# Altium project MoonPilot_Logic.PrjPcb
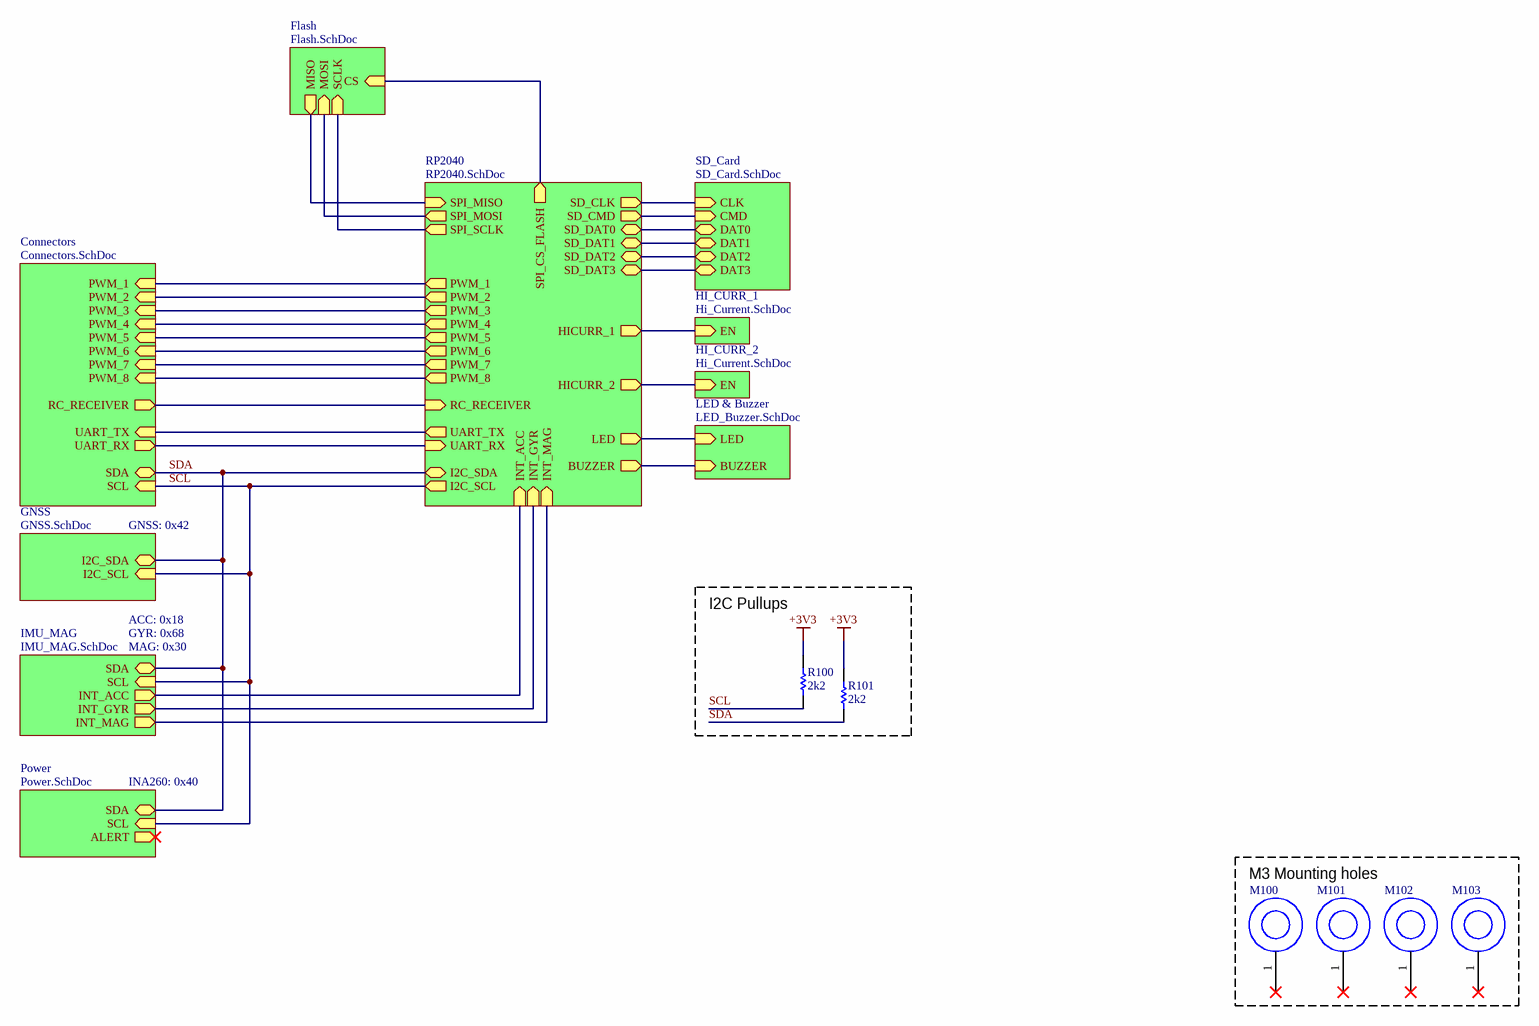
[diagram p0: Main.SchDoc]
11 sheets, 139 parts. Net scope: hierarchical (ports join the sheet entries above them; power ports are global).
Board file: MoonPilot_Logic.PcbDoc
Sheets:
  Main.SchDoc
    RP2040 = RP2040.SchDoc
    GNSS = GNSS.SchDoc
    IMU_MAG = IMU_MAG.SchDoc
    Power = Power.SchDoc
    Connectors = Connectors.SchDoc
    HI_CURR_1 = Hi_Current.SchDoc
    HI_CURR_2 = Hi_Current.SchDoc
    SD_Card = SD_Card.SchDoc
    Flash = Flash.SchDoc
  MCU_3.6.SchDoc
  RGB_LED.SchDoc

## Sheet Main.SchDoc: MoonPilot - Main
size A3; DrawnBy: Máni Magnússon; Revision: A; SheetNumber: 1

### Parts
M100  Mounting Screw  [M3_SCREW]  (value not drawn)
M101  Mounting Screw  [M3_SCREW]  (value not drawn)
M102  Mounting Screw  [M3_SCREW]  (value not drawn)
M103  Mounting Screw  [M3_SCREW]  (value not drawn)
R100  2k2  [0603_RES]
R101  2k2  [0603_RES]

### Blocks framed on the sheet
I2C Pullups: R100 R101
M3 Mounting holes: M100-M103

### Sub-sheets
Connectors = Connectors.SchDoc: PWM_1 (in), PWM_2 (in), PWM_3 (in), PWM_4 (in), PWM_5 (in), PWM_6 (in), PWM_7 (in), PWM_8 (in), SDA (bidir), SCL (in), RC_RECEIVER (out), UART_TX (in), UART_RX (out)
Flash = Flash.SchDoc: MISO (out), MOSI (in), SCLK (in), CS (in)
GNSS = GNSS.SchDoc: I2C_SCL (in), I2C_SDA (bidir)
HI_CURR_1 = Hi_Current.SchDoc: EN (in)
HI_CURR_2 = Hi_Current.SchDoc: EN (in)
IMU_MAG = IMU_MAG.SchDoc: SDA (bidir), SCL (in), INT_ACC (out), INT_GYR (out), INT_MAG (out)
LED & Buzzer = LED_Buzzer.SchDoc (file not in this document): BUZZER (in), LED (in)
Power = Power.SchDoc: SCL (in), SDA (bidir), ALERT (out)
RP2040 = RP2040.SchDoc: PWM_1 (out), PWM_2 (out), PWM_3 (out), PWM_4 (out), PWM_5 (out), PWM_6 (out), PWM_7 (out), PWM_8 (out), HICURR_1 (out), HICURR_2 (out), UART_TX (out), UART_RX (in), I2C_SDA (bidir), I2C_SCL (out), SPI_MISO (in), SPI_MOSI (out), SPI_SCLK (out), SPI_CS_FLASH (out), SD_CLK (out), SD_CMD (out), SD_DAT0 (bidir), SD_DAT1 (bidir), SD_DAT2 (bidir), SD_DAT3 (bidir), RC_RECEIVER (in), LED (out), INT_MAG (in), INT_GYR (in), INT_ACC (in), BUZZER (out)
SD_Card = SD_Card.SchDoc: CLK (in), CMD (in), DAT0 (bidir), DAT1 (bidir), DAT2 (bidir), DAT3 (bidir)

### Nets
+3V3: R100.1 R101.1
SCL: R100.2 ; sheet RP2040/I2C_SCL, sheet GNSS/I2C_SCL, sheet IMU_MAG/SCL, sheet Power/SCL, sheet Connectors/SCL
SDA: R101.2 ; sheet RP2040/I2C_SDA, sheet GNSS/I2C_SDA, sheet IMU_MAG/SDA, sheet Power/SDA, sheet Connectors/SDA
NetJ600_1: sheet RP2040/PWM_1, sheet Connectors/PWM_1
NetJ601_1: sheet RP2040/PWM_2, sheet Connectors/PWM_2
NetJ602_1: sheet RP2040/PWM_3, sheet Connectors/PWM_3
NetJ603_1: sheet RP2040/PWM_4, sheet Connectors/PWM_4
NetJ604_1: sheet RP2040/PWM_5, sheet Connectors/PWM_5
NetJ605_2: sheet RP2040/RC_RECEIVER, sheet Connectors/RC_RECEIVER
NetJ606_1: sheet RP2040/PWM_6, sheet Connectors/PWM_6
NetJ607_1: sheet RP2040/PWM_7, sheet Connectors/PWM_7
NetJ608_1: sheet RP2040/PWM_8, sheet Connectors/PWM_8
NetJ609_2: sheet RP2040/UART_RX, sheet Connectors/UART_RX
NetJ609_3: sheet RP2040/UART_TX, sheet Connectors/UART_TX
NetJ800_P1: sheet RP2040/SD_DAT2, sheet SD_Card/DAT2
NetJ800_P2: sheet RP2040/SD_DAT3, sheet SD_Card/DAT3
NetJ800_P3: sheet RP2040/SD_CMD, sheet SD_Card/CMD
NetJ800_P5: sheet RP2040/SD_CLK, sheet SD_Card/CLK
NetJ800_P7: sheet RP2040/SD_DAT0, sheet SD_Card/DAT0
NetJ800_P8: sheet RP2040/SD_DAT1, sheet SD_Card/DAT1
NetR?_1: sheet RP2040/SPI_CS_FLASH, sheet Flash/CS
NetU201_11: sheet RP2040/INT_ACC, sheet IMU_MAG/INT_ACC
NetU201_12: sheet RP2040/INT_GYR, sheet IMU_MAG/INT_GYR
NetU201_13: sheet RP2040/INT_MAG, sheet IMU_MAG/INT_MAG
NetU201_14: sheet RP2040/BUZZER, sheet LED & Buzzer/BUZZER
NetU201_27: sheet RP2040/SPI_MISO, sheet Flash/MISO
NetU201_29: sheet RP2040/SPI_SCLK, sheet Flash/SCLK
NetU201_30: sheet RP2040/SPI_MOSI, sheet Flash/MOSI
NetU201_32: sheet RP2040/LED, sheet LED & Buzzer/LED
NetU201_40: sheet RP2040/HICURR_1, sheet HI_CURR_1/EN
NetU201_41: sheet RP2040/HICURR_2, sheet HI_CURR_2/EN

Not connected (* = marked no-connect by the designer): M100 1(19)*; M101 1(19)*; M102 1(19)*; M103 1(19)*

### Notes on the sheet
- GNSS: 0x42
- ACC: 0x18
- GYR: 0x68
- MAG: 0x30
- INA260: 0x40
- Sheet title:
- Revision:
- Drawn by:
- Date:
- File:

### Library data of the parts
M100-M103 = Mounting Screw: M4 and M3 scew holes, just pick the right footprint
R100 R101 = Resistor

## Sheet RP2040.SchDoc: MoonPilot - RP2040
size A3; DrawnBy: Máni Magnússon; Revision: A; SheetNumber: 2
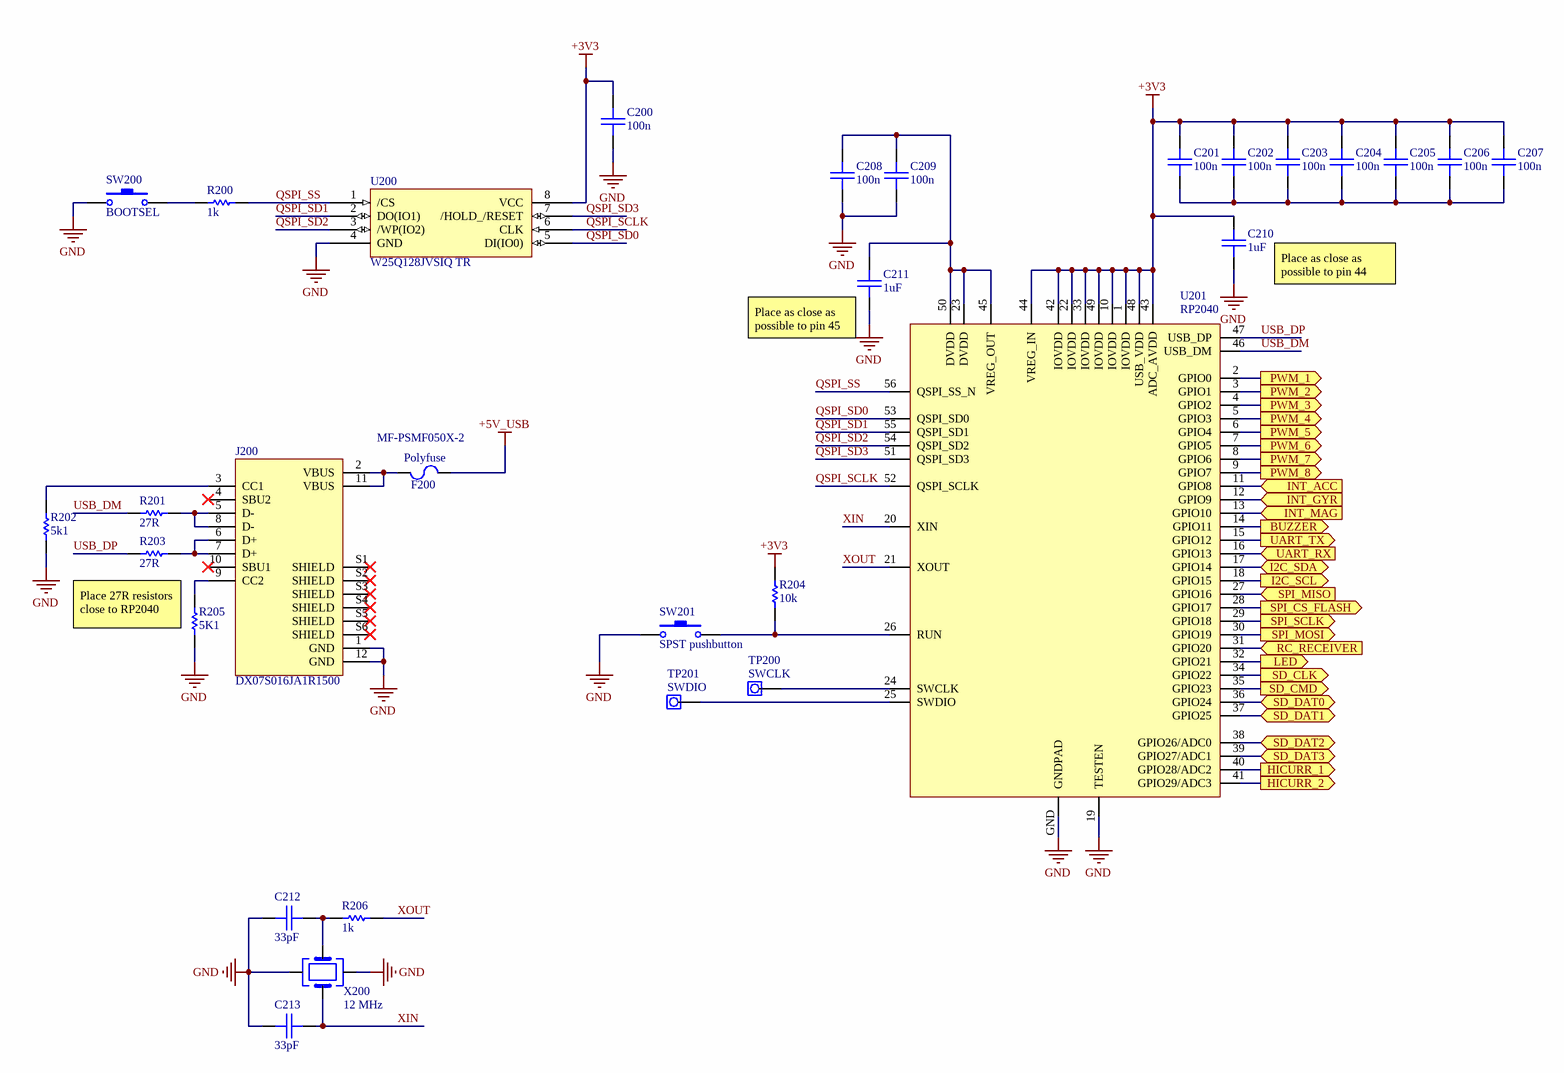
[diagram p1: RP2040.SchDoc]

### Parts
C200  100n  [0603_CAP]
C201  100n  [0603_CAP]
C202  100n  [0603_CAP]
C203  100n  [0603_CAP]
C204  100n  [0603_CAP]
C205  100n  [0603_CAP]
C206  100n  [0603_CAP]
C207  100n  [0603_CAP]
C208  100n  [0603_CAP]
C209  100n  [0603_CAP]
C210  1uF  [0603_CAP]
C211  1uF  [0603_CAP]
C212  33pF  [0603_CAP]
C213  33pF  [0603_CAP]
F200  Polyfuse  [0805]
J200  DX07S016JA1R1500  [JAE_DX07S016JA1R1500]
R200  1k  [0603_RES]
R201  27R  [0603_RES]
R202  5k1  [0603_RES]
R203  27R  [0603_RES]
R204  10k  [0805_RES]
R205  5K1  [0603_RES]
R206  1k  [0603_RES]
SW200  BOOTSEL  [TL1015]
SW201  SPST pushbutton  [TL1015]
TP200  SWCLK  [Testpoint]
TP201  SWDIO  [Testpoint]
U200  W25Q128JVSIQ TR  [SOIC_208MIL_WIN]
U201  RP2040  [RP2040]
X200  12 MHz  [XOSC_3.2mmx2.5mm]

### Ports
BUZZER (out), HICURR_1 (out), HICURR_2 (out), I2C_SCL (out), I2C_SDA (bidir), INT_ACC (in), INT_GYR (in), INT_MAG (in), LED (out), PWM_1 (out), PWM_2 (out), PWM_3 (out), PWM_4 (out), PWM_5 (out), PWM_6 (out), PWM_7 (out), PWM_8 (out), RC_RECEIVER (in), SD_CLK (out), SD_CMD (out), SD_DAT0 (bidir), SD_DAT1 (bidir), SD_DAT2 (bidir), SD_DAT3 (bidir), SPI_CS_FLASH (out), SPI_MISO (in), SPI_MOSI (out), SPI_SCLK (out), UART_RX (in), UART_TX (out)

### Nets
+3V3: C200.1 C201.1 C202.1 C203.1 C204.1 C205.1 C206.1 C207.1 C210.1 R204.1 U200.8(VCC) U201.1(IOVDD) U201.10(IOVDD) U201.22(IOVDD) U201.33(IOVDD) U201.42(IOVDD) U201.43(ADC_AVDD) U201.44(VREG_IN) U201.48(USB_VDD) U201.49(IOVDD)
+5V_USB: F200.2
GND: C200.2 C208.2 C209.2 C210.2 C211.2 C212.2 C213.2 J200.1(GND) J200.12(GND) R202.2 R205.2 SW200.1 SW201.1 U200.4(GND) U201.19(TESTEN) U201.GND(GNDPAD) X200.2 X200.4
QSPI_SCLK: U200.6(CLK) U201.52(QSPI_SCLK)
QSPI_SD0: U200.5(DI(IO0)) U201.53(QSPI_SD0)
QSPI_SD1: U200.2(DO(IO1)) U201.55(QSPI_SD1)
QSPI_SD2: U200.3(/WP(IO2)) U201.54(QSPI_SD2)
QSPI_SD3: U200.7(/HOLD_/RESET) U201.51(QSPI_SD3)
QSPI_SS: R200.2 U200.1(/CS) U201.56(QSPI_SS_N)
SCL: U201.18(GPIO15) ; port I2C_SCL
SDA: U201.17(GPIO14) ; port I2C_SDA
USB_DM: R201.1 U201.46(USB_DM)
USB_DP: R203.1 U201.47(USB_DP)
XIN: C213.1 U201.20(XIN) X200.1
XOUT: R206.1 U201.21(XOUT)
NetC201_2: C201.2 C202.2 C203.2 C204.2 C205.2 C206.2 C207.2
NetC208_1: C208.1 C209.1 C211.1 U201.23(DVDD) U201.45(VREG_OUT) U201.50(DVDD)
NetC212_1: C212.1 R206.2 X200.3
NetF200_1: F200.1 J200.2(VBUS) J200.11(VBUS)
NetJ200_3: J200.3(CC1) R202.1
NetJ200_5: J200.5(D-) J200.8(D-) R201.2
NetJ200_6: J200.6(D+) J200.7(D+) R203.2
NetJ200_9: J200.9(CC2) R205.1
NetJ600_1: U201.2(GPIO0) ; port PWM_1
NetJ601_1: U201.3(GPIO1) ; port PWM_2
NetJ602_1: U201.4(GPIO2) ; port PWM_3
NetJ603_1: U201.5(GPIO3) ; port PWM_4
NetJ604_1: U201.6(GPIO4) ; port PWM_5
NetJ605_2: U201.31(GPIO20) ; port RC_RECEIVER
NetJ606_1: U201.7(GPIO5) ; port PWM_6
NetJ607_1: U201.8(GPIO6) ; port PWM_7
NetJ608_1: U201.9(GPIO7) ; port PWM_8
NetJ609_2: U201.16(GPIO13) ; port UART_RX
NetJ609_3: U201.15(GPIO12) ; port UART_TX
NetJ800_P1: U201.38(GPIO26/ADC0) ; port SD_DAT2
NetJ800_P2: U201.39(GPIO27/ADC1) ; port SD_DAT3
NetJ800_P3: U201.35(GPIO23) ; port SD_CMD
NetJ800_P5: U201.34(GPIO22) ; port SD_CLK
NetJ800_P7: U201.36(GPIO24) ; port SD_DAT0
NetJ800_P8: U201.37(GPIO25) ; port SD_DAT1
NetR200_1: R200.1 SW200.2
NetR204_2: R204.2 SW201.2 U201.26(RUN)
NetR?_1: U201.28(GPIO17) ; port SPI_CS_FLASH
NetTP200_1: TP200.1 U201.24(SWCLK)
NetTP201_1: TP201.1 U201.25(SWDIO)
NetU201_11: U201.11(GPIO8) ; port INT_ACC
NetU201_12: U201.12(GPIO9) ; port INT_GYR
NetU201_13: U201.13(GPIO10) ; port INT_MAG
NetU201_14: U201.14(GPIO11) ; port BUZZER
NetU201_27: U201.27(GPIO16) ; port SPI_MISO
NetU201_29: U201.29(GPIO18) ; port SPI_SCLK
NetU201_30: U201.30(GPIO19) ; port SPI_MOSI
NetU201_32: U201.32(GPIO21) ; port LED
NetU201_40: U201.40(GPIO28/ADC2) ; port HICURR_1
NetU201_41: U201.41(GPIO29/ADC3) ; port HICURR_2

Not connected (* = marked no-connect by the designer): J200 4(SBU2)* 10(SBU1)* S1(SHIELD)* S2(SHIELD)* S3(SHIELD)* S4(SHIELD)* S5(SHIELD)* S6(SHIELD)*

### Notes on the sheet
- (near C210) Place as close as possible to pin 44
- (near C211) Place as close as possible to pin 45
- MF-PSMF050X-2
- (near R205) Place 27R resistors close to RP2040
- Sheet title:
- Revision:
- Drawn by:
- Date:
- File:

### Library data of the parts
C200-C213 = Capacitor
F200 = Fuse
J200 = DX07S016JA1R1500: USB 2.0 Type C Receptacle Dip Type, PCB Top Mount (Digikey part no. 670-DX07S016JA1R1500CT-ND); MF: JAE Electronics; Value: *; Price: None; Package: None; Availability: Unavailable; MP: DX07S016JA1R1500; DigiKey-Purchase-URL: https://snapeda.com/shop?store=DigiKey&id=4551013; SnapEDA_Link: https://www.snapeda.com/parts/DX07S016JA1R1500/JAE%20Electronics/view-part/4551013/?ref=snap
R200-R206 = Resistor
SW200 SW201 = PushButton: DigiKey part no. EG4344CT-ND
TP200 TP201 = Testpoint
U200 = W25Q128JVSIQ TR: No Description Available; Vendor: Winbond; Built_By: EMA_Cory; SourceLibrary: Winbond_2020-02-06; Datasheet: https://www.winbond.com/resource-files/w25q128jv%20revf%2003272018%20plus.pdf; Manufacturer_Part_Number: W25Q128JVSIQ TR; Copyright: Copyright (C) 2018 Accelerated Designs. All rights reserved; RefDes: RefDes; Type: DEV
X200 = XTAL_12 MHz: 12 MHz crystal oscillator / ECS-120-20-33-CKM-TR / DigiKey part no. XC1810CT-ND; ComponentLink1Description: DigiKey; ComponentLink1URL: https://www.digikey.com/en/products/detail/ecs-inc/ECS-120-20-33-CKM-TR/2781815; DigiKey: XC1810CT-ND

## Sheet GNSS.SchDoc: MoonPilot - GNSS
size A3; DrawnBy: Máni Magnússon; Revision: A; SheetNumber: 3
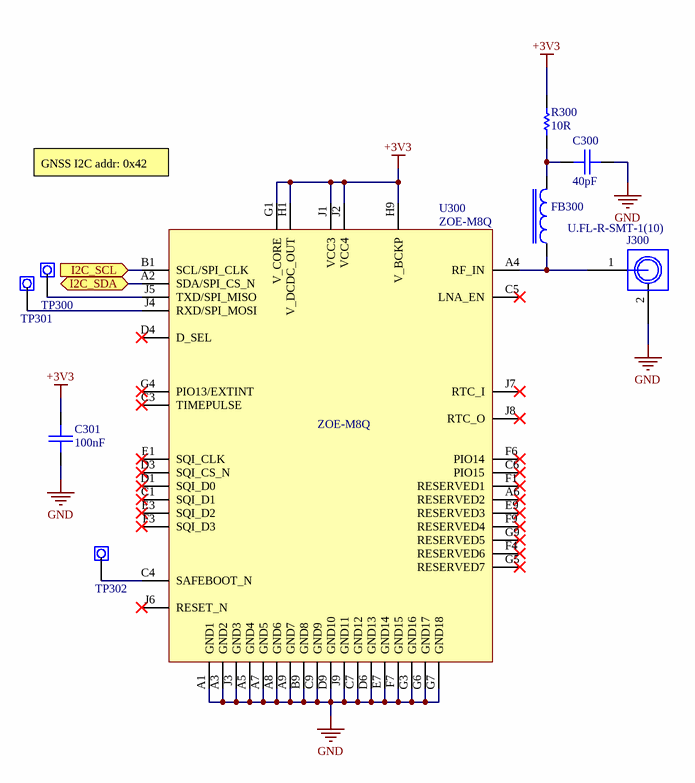
[diagram p2: GNSS.SchDoc]

### Parts
C300  40pF  [0603_CAP]
C301  100nF  [0603_CAP]
FB300  FBTH1608HL221-T  [0603_FERRITE]  (value not drawn)
J300  U.FL-R-SMT-1(10)  [U.FL-R-SMT-1(10)]
R300  10R  [0603_RES]
TP300  GPS_TX  [Testpoint]  (value not drawn)
TP301  GPS_RX  [Testpoint]  (value not drawn)
TP302  GPS_SAFEBOOT  [Testpoint2]  (value not drawn)
U300  ZOE-M8Q  [ZOE-M8Q]

### Ports
I2C_SCL (in), I2C_SDA (bidir)

### Nets
+3V3: C301.1 R300.1 U300.G1(V_CORE) U300.H1(V_DCDC_OUT) U300.H9(V_BCKP) U300.J1(VCC3) U300.J2(VCC4)
GND: C300.2 C301.2 J300.2(GND) U300.A1(GND1) U300.A3(GND2) U300.A5(GND4) U300.A7(GND5) U300.A8(GND6) U300.A9(GND7) U300.B9(GND8) U300.C7(GND12) U300.C9(GND9) U300.D6(GND13) U300.D9(GND10) U300.E7(GND14) U300.F7(GND15) U300.G3(GND16) U300.G6(GND17) U300.G7(GND18) U300.J3(GND3) U300.J9(GND11)
SCL: U300.B1(SCL/SPI_CLK) ; port I2C_SCL
SDA: U300.A2(SDA/SPI_CS_N) ; port I2C_SDA
NetC300_1: C300.1 FB300.2 R300.2
NetFB300_1: FB300.1 J300.1(SIG) U300.A4(RF_IN)
NetTP300_1: TP300.1 U300.J5(TXD/SPI_MISO)
NetTP301_1: TP301.1 U300.J4(RXD/SPI_MOSI)
NetTP302_1: TP302.1 U300.C4(SAFEBOOT_N)

Not connected (* = marked no-connect by the designer): U300 A6(RESERVED2)* C1(SQI_D1)* C3(TIMEPULSE)* C5(LNA_EN)* C6(PIO15)* D1(SQI_D0)* D3(SQI_CS_N)* D4(D_SEL)* E1(SQI_CLK)* E3(SQI_D2)* E9(RESERVED3)* F1(RESERVED1)* F3(SQI_D3)* F4(RESERVED6)* F6(PIO14)* F9(RESERVED4)* G4(PIO13/EXTINT)* G5(RESERVED7)* G9(RESERVED5)* J6(RESET_N)* J7(RTC_I)* J8(RTC_O)*

### Notes on the sheet
- GNSS I2C addr: 0x42
- Sheet title:
- Revision:
- Drawn by:
- Date:
- File:

### Library data of the parts
C300 C301 = Capacitor
FB300 = Ferrite Bead: Digikey part no. / 587-FBTH1608HL221-TCT-ND
J300 = U.FL SMD: Digikey part no. H11891CT-ND
R300 = Resistor
TP300-TP302 = Testpoint
U300 = ZOE-M8Q: u-blox ZOE GNSS module; Part Description: u-blox ZOE-M8Q GNSS module; Manufacturer: u-blox; Value: ZOE-M8Q

## Sheet IMU_MAG.SchDoc: MoonPilot - IMU & MAG
size A3; DrawnBy: Máni Magnússon; Revision: A; SheetNumber: 4
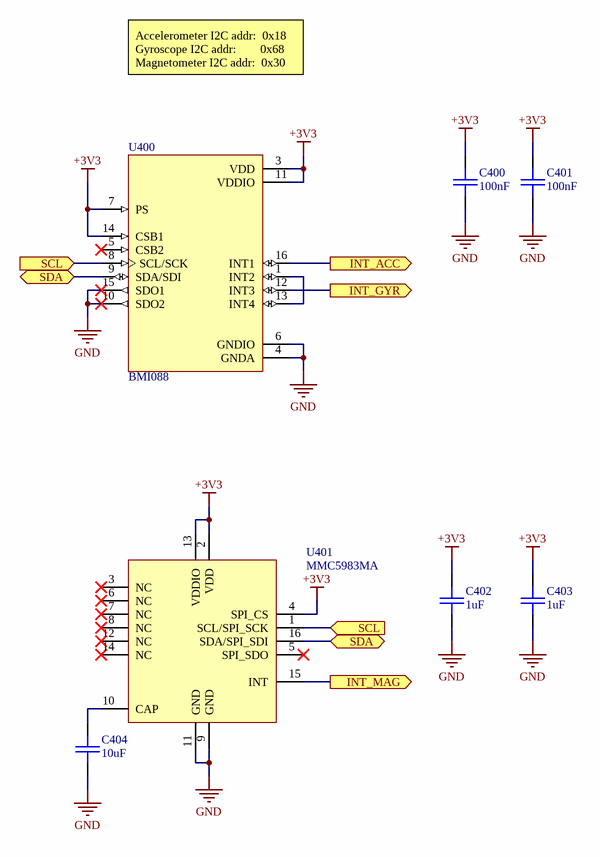
[diagram p3: IMU_MAG.SchDoc]

### Parts
C400  100nF  [0603_CAP]
C401  100nF  [0603_CAP]
C402  1uF  [0603_CAP]
C403  1uF  [0603_CAP]
C404  10uF  [0603_CAP]
U400  BMI088  [BMI088]
U401  MMC5983MA  [MMC5983MA]

### Ports
INT_ACC (out), INT_GYR (out), INT_MAG (out), SCL (in), SDA (bidir)

### Nets
+3V3: C400.1 C401.1 C402.1 C403.1 U400.3(VDD) U400.7(PS) U400.11(VDDIO) U400.14(CSB1) U401.2(VDD) U401.4(SPI_CS) U401.13(VDDIO)
GND: C400.2 C401.2 C402.2 C403.2 C404.2 U400.4(GNDA) U400.6(GNDIO) U400.10(SDO2) U400.15(SDO1) U401.9(GND) U401.11(GND)
SCL: U400.8(SCL/SCK) U401.1(SCL/SPI_SCK) ; port SCL
SDA: U400.9(SDA/SDI) U401.16(SDA/SPI_SDI) ; port SDA
NetC404_1: C404.1 U401.10(CAP)
NetU201_11: U400.16(INT1) ; port INT_ACC
NetU201_12: U400.12(INT3) ; port INT_GYR
NetU201_13: U401.15(INT) ; port INT_MAG
NetU400_1: U400.1(INT2) U400.13(INT4)

Not connected (* = marked no-connect by the designer): U400 5(CSB2)*; U401 3(NC)* 5(SPI_SDO)* 6(NC)* 7(NC)* 8(NC)* 12(NC)* 14(NC)*

### Notes on the sheet
- Accelerometer I2C addr:  0x18
  Gyroscope I2C addr:        0x68
  Magnetometer I2C addr:  0x30
- Sheet title:
- Revision:
- Drawn by:
- Date:
- File:

### Library data of the parts
C400-C404 = Capacitor
U400 = BMI088: Digikey part no. 828-1082-1-ND; MF: Bosch Sensortec; Availability: Unavailable; MP: BMI088; Price: None; Value: *; SnapEDA_Link: https://www.snapeda.com/parts/BMI088/Bosch%20Sensortec/view-part/2774026/?ref=snap; Package: VFLGA-16 Bosch Sensortec
U401 = MMC5983MA: 3 axis magnetometer; Supplier 1: Digi-Key; Supplier Part Number 1: 1267-MMC5983MACT-ND

## Sheet Power.SchDoc: MoonPilot -  Power
size A3; DrawnBy: Máni Magnússon; Revision: A; SheetNumber: 5
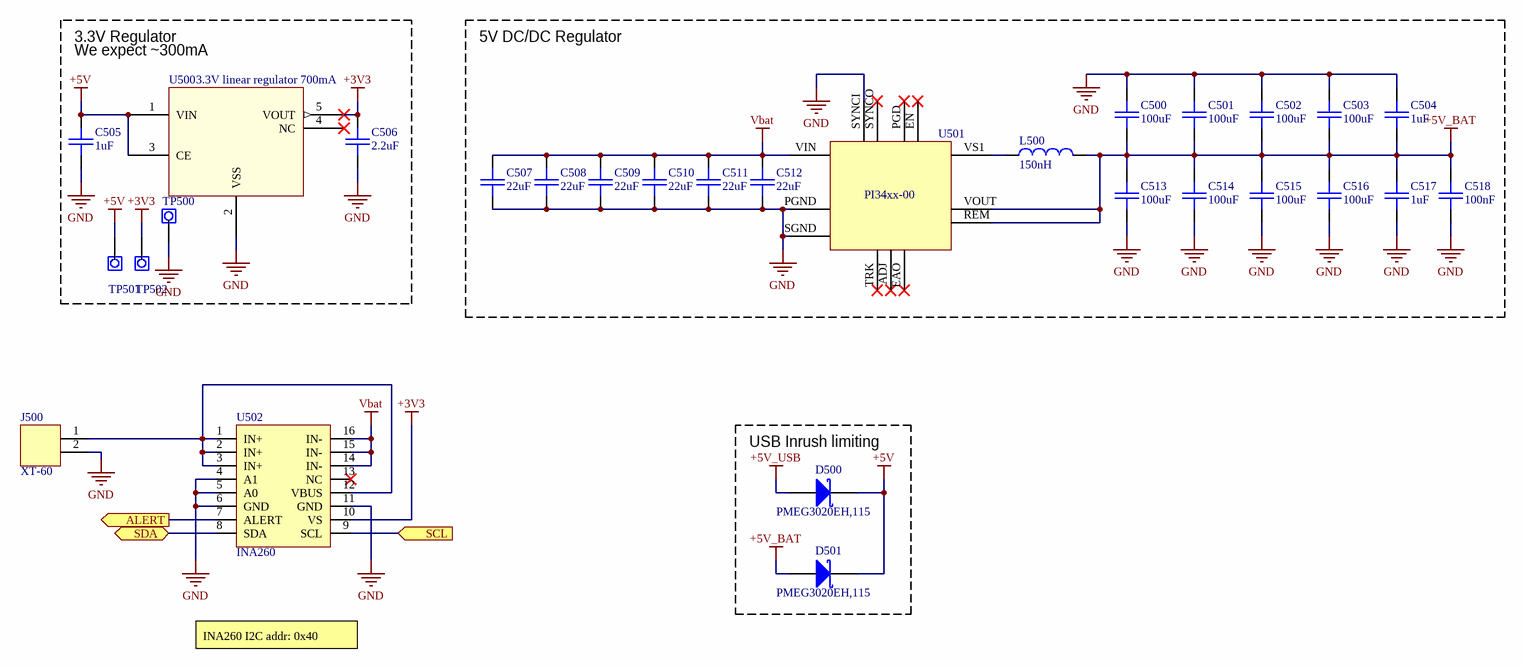
[diagram p4: Power.SchDoc]

### Parts
C500  100uF  [1206_CAP]
C501  100uF  [1206_CAP]
C502  100uF  [1206_CAP]
C503  100uF  [1206_CAP]
C504  1uF  [0805_cap]
C505  1uF  [0603_CAP]
C506  2.2uF  [0603_CAP]
C507  22uF  [1206_CAP]
C508  22uF  [1206_CAP]
C509  22uF  [1206_CAP]
C510  22uF  [1206_CAP]
C511  22uF  [1206_CAP]
C512  22uF  [1206_CAP]
C513  100uF  [1206_CAP]
C514  100uF  [1206_CAP]
C515  100uF  [1206_CAP]
C516  100uF  [1206_CAP]
C517  1uF  [0805_cap]
C518  100nF  [1206_CAP]
D500  PMEG3020EH,115  [SOD-123]
D501  PMEG3020EH,115  [SOD-123]
J500  XT-60  [XT-60]
L500  150nH  [FPV1006-150-R]
TP500  GND  [Testpoint2]  (value not drawn)
TP501  5V  [Testpoint2]  (value not drawn)
TP502  3.3V  [Testpoint2]  (value not drawn)
U500  3.3V linear regulator 700mA  [SOT-25_TOR]
U501  PI34xx-00  [PI34xx-00]
U502  INA260  [TSSOP-16]

### Blocks framed on the sheet
5V DC/DC Regulator: C500-C504 C507-C518 L500 U501
USB Inrush limiting: D500 D501

### Ports
ALERT (out), SCL (in), SDA (bidir)

### Nets
+3V3: C506.1 TP502.1 U500.5(VOUT) U502.10(VS)
+5V: C505.1 D500.2(K) D501.2(K) TP501.1 U500.1(VIN) U500.3(CE)
+5V_BAT: C500.2 C501.2 C502.2 C503.2 C504.2 C513.1 C514.1 C515.1 C516.1 C517.1 C518.1 D501.1(A) L500.2 U501.REM U501.VOUT
+5V_USB: D500.1(A)
GND: C500.1 C501.1 C502.1 C503.1 C504.1 C505.2 C506.2 C507.2 C508.2 C509.2 C510.2 C511.2 C512.2 C513.2 C514.2 C515.2 C516.2 C517.2 C518.2 J500.2 TP500.1 U500.2(VSS) U501.PGND U501.SGND U501.SYNCI U502.4(A1) U502.5(A0) U502.6(GND) U502.11(GND)
Vbat: C507.1 C508.1 C509.1 C510.1 C511.1 C512.1 U501.VIN U502.14(IN-) U502.15(IN-) U502.16(IN-)
SCL: U502.9(SCL) ; port SCL
SDA: U502.8(SDA) ; port SDA
NetJ500_1: J500.1 U502.1(IN+) U502.2(IN+) U502.3(IN+) U502.12(VBUS)
NetL500_1: L500.1 U501.VS1
NetU502_7: U502.7(ALERT) ; port ALERT

Not connected (* = marked no-connect by the designer): U500 4(NC)*; U501 ADJ* EAO* EN* PGD* SYNCO* TRK*; U502 13(NC)*

### Notes on the sheet
- 3.3V Regulator
- We expect ~300mA
- INA260 I2C addr: 0x40
- Sheet title:
- Revision:
- Drawn by:
- Date:
- File:

### Library data of the parts
C500-C518 = Capacitor
D500 D501 = Schottky diode
J500 = XT-60: Digikey part no. 1568-1816-ND
L500 = Inductor
TP500-TP502 = Testpoint
U500 = XC6222B331MR-G: Digikey part no. 893-1143-1-ND; Vendor: Torex Semiconductor; Built_By: EMA_UL_Team; SourceLibrary: Torex_2016-07-11_1; Manufacturer_Part_Number: XC6222B331MR-G; Copyright: Copyright (C) 2018 Accelerated Designs. All rights reserved; RefDes: RefDes; Type: DEV
U501 = PI34xx-00: Digikey part no. 1102-1641-ND
U502 = INA260: ComponentLink1Description: Datasheet; ComponentLink1URL: https://www.ti.com/lit/ds/symlink/ina260.pdf?ts=1625223015380&ref_url=https%253A%252F%252Fwww.google.com%252F

## Sheet Connectors.SchDoc: MoonPilot - Connectors
size A3; DrawnBy: Máni Magnússon; Revision: A; SheetNumber: 6
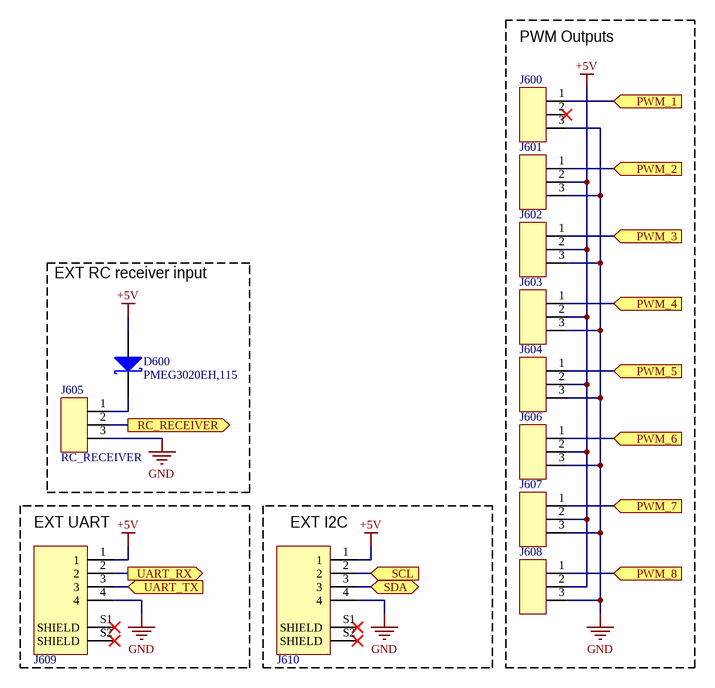
[diagram p5: Connectors.SchDoc]

### Parts
D600  PMEG3020EH,115  [SOD-123]
J600  Generic 3 pin 100 mil header  [HEADER-3-POS_100_mil]  (value not drawn)
J601  Generic 3 pin 100 mil header  [HEADER-3-POS_100_mil]  (value not drawn)
J602  Generic 3 pin 100 mil header  [HEADER-3-POS_100_mil]  (value not drawn)
J603  Generic 3 pin 100 mil header  [HEADER-3-POS_100_mil]  (value not drawn)
J604  Generic 3 pin 100 mil header  [HEADER-3-POS_100_mil]  (value not drawn)
J605  RC_RECEIVER  [HEADER-3-POS_100_mil]
J606  Generic 3 pin 100 mil header  [HEADER-3-POS_100_mil]  (value not drawn)
J607  Generic 3 pin 100 mil header  [HEADER-3-POS_100_mil]  (value not drawn)
J608  Generic 3 pin 100 mil header  [HEADER-3-POS_100_mil]  (value not drawn)
J609  4 pin vertical JST GH  [JST_BM04B-GHS-TBT(LF)(SN)(N)]  (value not drawn)
J610  4 pin vertical JST GH  [JST_BM04B-GHS-TBT(LF)(SN)(N)]  (value not drawn)

### Blocks framed on the sheet
PWM Outputs: J600-J604 J606-J608
EXT RC receiver input: D600 J605
EXT UART: J609
EXT I2C: J610

### Ports
PWM_1 (in), PWM_2 (in), PWM_3 (in), PWM_4 (in), PWM_5 (in), PWM_6 (in), PWM_7 (in), PWM_8 (in), RC_RECEIVER (out), SCL (in), SDA (bidir), UART_RX (out), UART_TX (in)

### Nets
+5V: D600.1(A) J601.2 J602.2 J603.2 J604.2 J606.2 J607.2 J608.2 J609.1 J610.1
GND: J600.3 J601.3 J602.3 J603.3 J604.3 J605.3 J606.3 J607.3 J608.3 J609.4 J610.4
SCL: J610.2 ; port SCL
SDA: J610.3 ; port SDA
NetD600_2: D600.2(K) J605.1
NetJ600_1: J600.1 ; port PWM_1
NetJ601_1: J601.1 ; port PWM_2
NetJ602_1: J602.1 ; port PWM_3
NetJ603_1: J603.1 ; port PWM_4
NetJ604_1: J604.1 ; port PWM_5
NetJ605_2: J605.2 ; port RC_RECEIVER
NetJ606_1: J606.1 ; port PWM_6
NetJ607_1: J607.1 ; port PWM_7
NetJ608_1: J608.1 ; port PWM_8
NetJ609_2: J609.2 ; port UART_RX
NetJ609_3: J609.3 ; port UART_TX

Not connected (* = marked no-connect by the designer): J600 2(*)*; J609 S1(SHIELD)* S2(SHIELD)*; J610 S1(SHIELD)* S2(SHIELD)*

### Notes on the sheet
- Sheet title:
- Revision:
- Drawn by:
- Date:
- File:

### Library data of the parts
D600 = Schottky diode: Digikey part no. 1727-3873-1-ND
J600-J608 = 3 pin 100 mil header
J609 J610 = BM04B-GHS-TBT(LF)(SN)(N): JST GH vertical 4 pin / DigiKey part no. 455-1580-1-ND; MF: JST Sales; MP: BM04B-GHS-TBT_LF__SN__N_; SnapEDA_Link: https://www.snapeda.com/parts/BM04B-GHS-TBT%28LF%29%28SN%29%28N%29/JST%20Sales%20America%20Inc./view-part/841999/?ref=snap; Digi-Key_Part_Number: 455-1580-1-ND; Digi-Key_Purchase_URL: https://www.digikey.com/product-detail/en/jst-sales-america-inc/BM04B-GHS-TBT_LF__SN__N_/455-1580-1-ND/807848?utm_source=snapeda&utm_medium=aggregator&utm_campaign=symbol; Value: *; Package: None

## Sheet Hi_Current.SchDoc: MoonPilot - Hi Current Out
size A3; DrawnBy: Máni Magnússon; Revision: A
Used 2 times, as channels HI_CURR_1, HI_CURR_2. Parts and nets are listed once, with the designators drawn on the sheet.
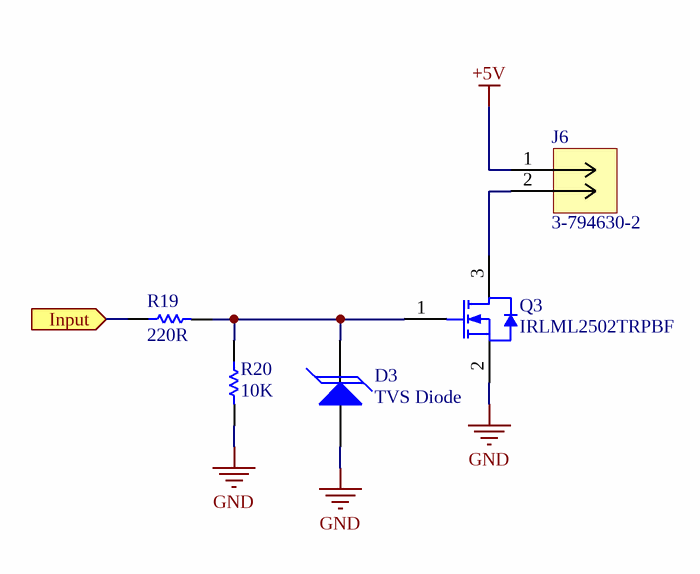
[diagram p6: Hi_Current.SchDoc]

### Parts
D3  TVS Diode  [SOD-123]
J6  3-794630-2  [3-794630-2]
Q3  IRLML2502TRPBF  [INTR-SOT-23-3_V]
R19  220R  [0603_RES]
R20  10K  [0603_RES]

### Ports
Input (in)

### Nets
+5V: J6.1
GND: D3.2(A) Q3.2(S) R20.2
Input: R19.1 ; port Input
NetD3_1: D3.1(K) Q3.1(G) R19.2 R20.1
NetJ6_2: J6.2 Q3.3(D)

### Channels
HI_CURR_1: designators end in _HI_CURR_1; ports Input=NetR19_HI_CURR_1_1
HI_CURR_2: designators end in _HI_CURR_2; ports Input=NetR19_HI_CURR_2_1

### Notes on the sheet
- Sheet title:
- Revision:
- Drawn by:
- Date:
- File:

### Library data of the parts
D3 = TVS Diode: PTVS3V3S1UR,115 / Digikey part no. 1727-5228-1-ND
J6 = 2 pin vertical molex: Digikey part no. A33219-ND; Vendor: TE Connectivity; Built_By: EMA_UL_Team; SourceLibrary: Tyco_2012-04-26; Manufacturer_Part_Number: 3-794630-2; Copyright: Copyright (C) 2018 Accelerated Designs. All rights reserved; RefDes: RefDes; Type: DEV
Q3 = IRLML2502TRPBF: N-Channel HEXFET(R) Power MOSFET, 20 V VDS, +/- 12 V VGS, 4.2 A, 3-Pin SOT23, RoHS, Tape and Reel; Manufacturer: International Rectifier; Drain-to-Source Voltage [Vdss]: 20V; Drain-Source On Resistance-Max: 0.045O; Qg Gate Charge: 8nC; Rated Power Dissipation: 1.25W; Package Reference: SOT-23-3; Manufacturer URL: http://internationalrectifier.com/; Package Description: 3-Pin Small Outline Transistor, Body 2.92 x 1.3 mm, Pitch 0.95 mm; Datasheet Version: Apr-14; Channel Type: N-Channel; Datasheet URL: https://datasheet.ciiva.com/6383/irlml2502pbf-6383216.pdf
R19 R20 = Resistor

## Sheet SD_Card.SchDoc: MoonPilot - SD Card
size A3; DrawnBy: Máni Magnússon; Revision: A; SheetNumber: 8
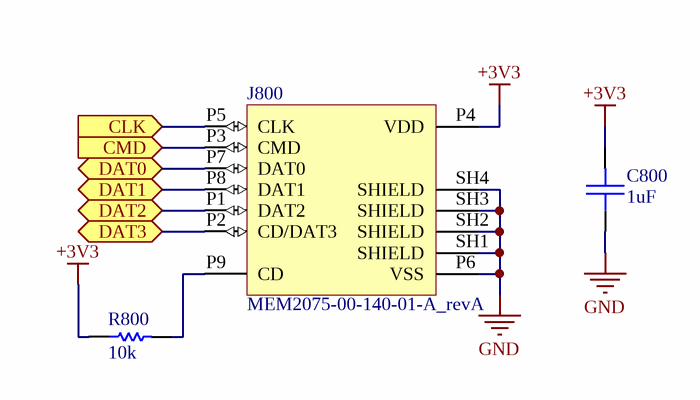
[diagram p7: SD_Card.SchDoc]

### Parts
C800  1uF  [0603_CAP]
J800  MEM2075-00-140-01-A_revA  [MEM2075-00-140-01-A_revA]
R800  10k  [0603_RES]

### Ports
CLK (in), CMD (in), DAT0 (bidir), DAT1 (bidir), DAT2 (bidir), DAT3 (bidir)

### Nets
+3V3: C800.1 J800.P4(VDD) R800.1
GND: C800.2 J800.P6(VSS) J800.SH1(SHIELD) J800.SH2(SHIELD) J800.SH3(SHIELD) J800.SH4(SHIELD)
NetJ800_P1: J800.P1(DAT2) ; port DAT2
NetJ800_P2: J800.P2(CD/DAT3) ; port DAT3
NetJ800_P3: J800.P3(CMD) ; port CMD
NetJ800_P5: J800.P5(CLK) ; port CLK
NetJ800_P7: J800.P7(DAT0) ; port DAT0
NetJ800_P8: J800.P8(DAT1) ; port DAT1
NetJ800_P9: J800.P9(CD) R800.2

### Notes on the sheet
- Sheet title:
- Revision:
- Drawn by:
- Date:
- File:

### Library data of the parts
C800 = Capacitor
J800 = MicroSD Card holder: Push-Push style MicroSD Card holder / Digikey part no. 2073-MEM2075-00-140-01-ACT-ND; Manufacturer: GCT; PartRev: A; STANDARD: Manufacturer Recommendations; Package: GCT_MEM2075-00-140-01-A_revA
R800 = Resistor

## Sheet Flash.SchDoc
size A3
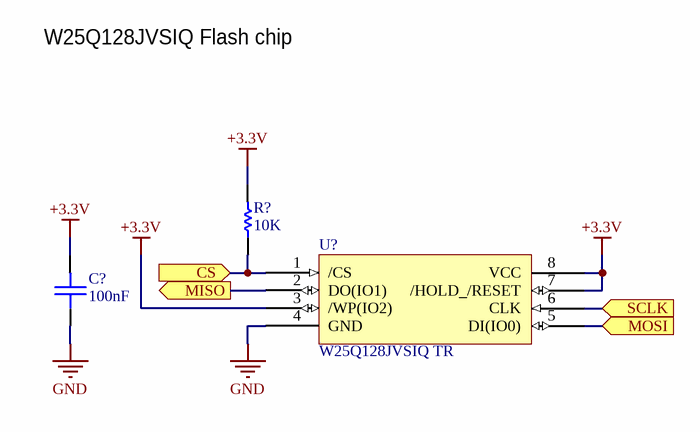
[diagram p8: Flash.SchDoc]

### Parts
C?  100nF  [0603_CAP]
R?  10K  [0603_RES]
U?  W25Q128JVSIQ TR  [SOIC_208MIL_WIN]

### Ports
CS (in), MISO (out), MOSI (in), SCLK (in)

### Nets
+3.3V: C?.1 R?.2 U?.3(/WP(IO2)) U?.7(/HOLD_/RESET) U?.8(VCC)
GND: C?.2 U?.4(GND)
NetR?_1: R?.1 U?.1(/CS) ; port CS
NetU201_27: U?.2(DO(IO1)) ; port MISO
NetU201_29: U?.6(CLK) ; port SCLK
NetU201_30: U?.5(DI(IO0)) ; port MOSI

### Notes on the sheet
- W25Q128JVSIQ Flash chip
- Sheet title:
- Revision:
- Drawn by:
- Date:
- File:

### Library data of the parts
C? = Capacitor
R? = Resistor
U? = W25Q128JVSIQ TR: as U200 on sheet RP2040; Datasheet: https://www.winbond.com/resource-files/w25q128jv%20revf%2003272018%20plus.pdf; Manufacturer_Part_Number: W25Q128JVSIQ TR; Copyright: Copyright (C) 2018 Accelerated Designs. All rights reserved; RefDes: RefDes; Type: DEV

## Sheet MCU_3.6.SchDoc: MCU_3.6
size A3; DrawnBy: Máni Magnússon; Revision: A
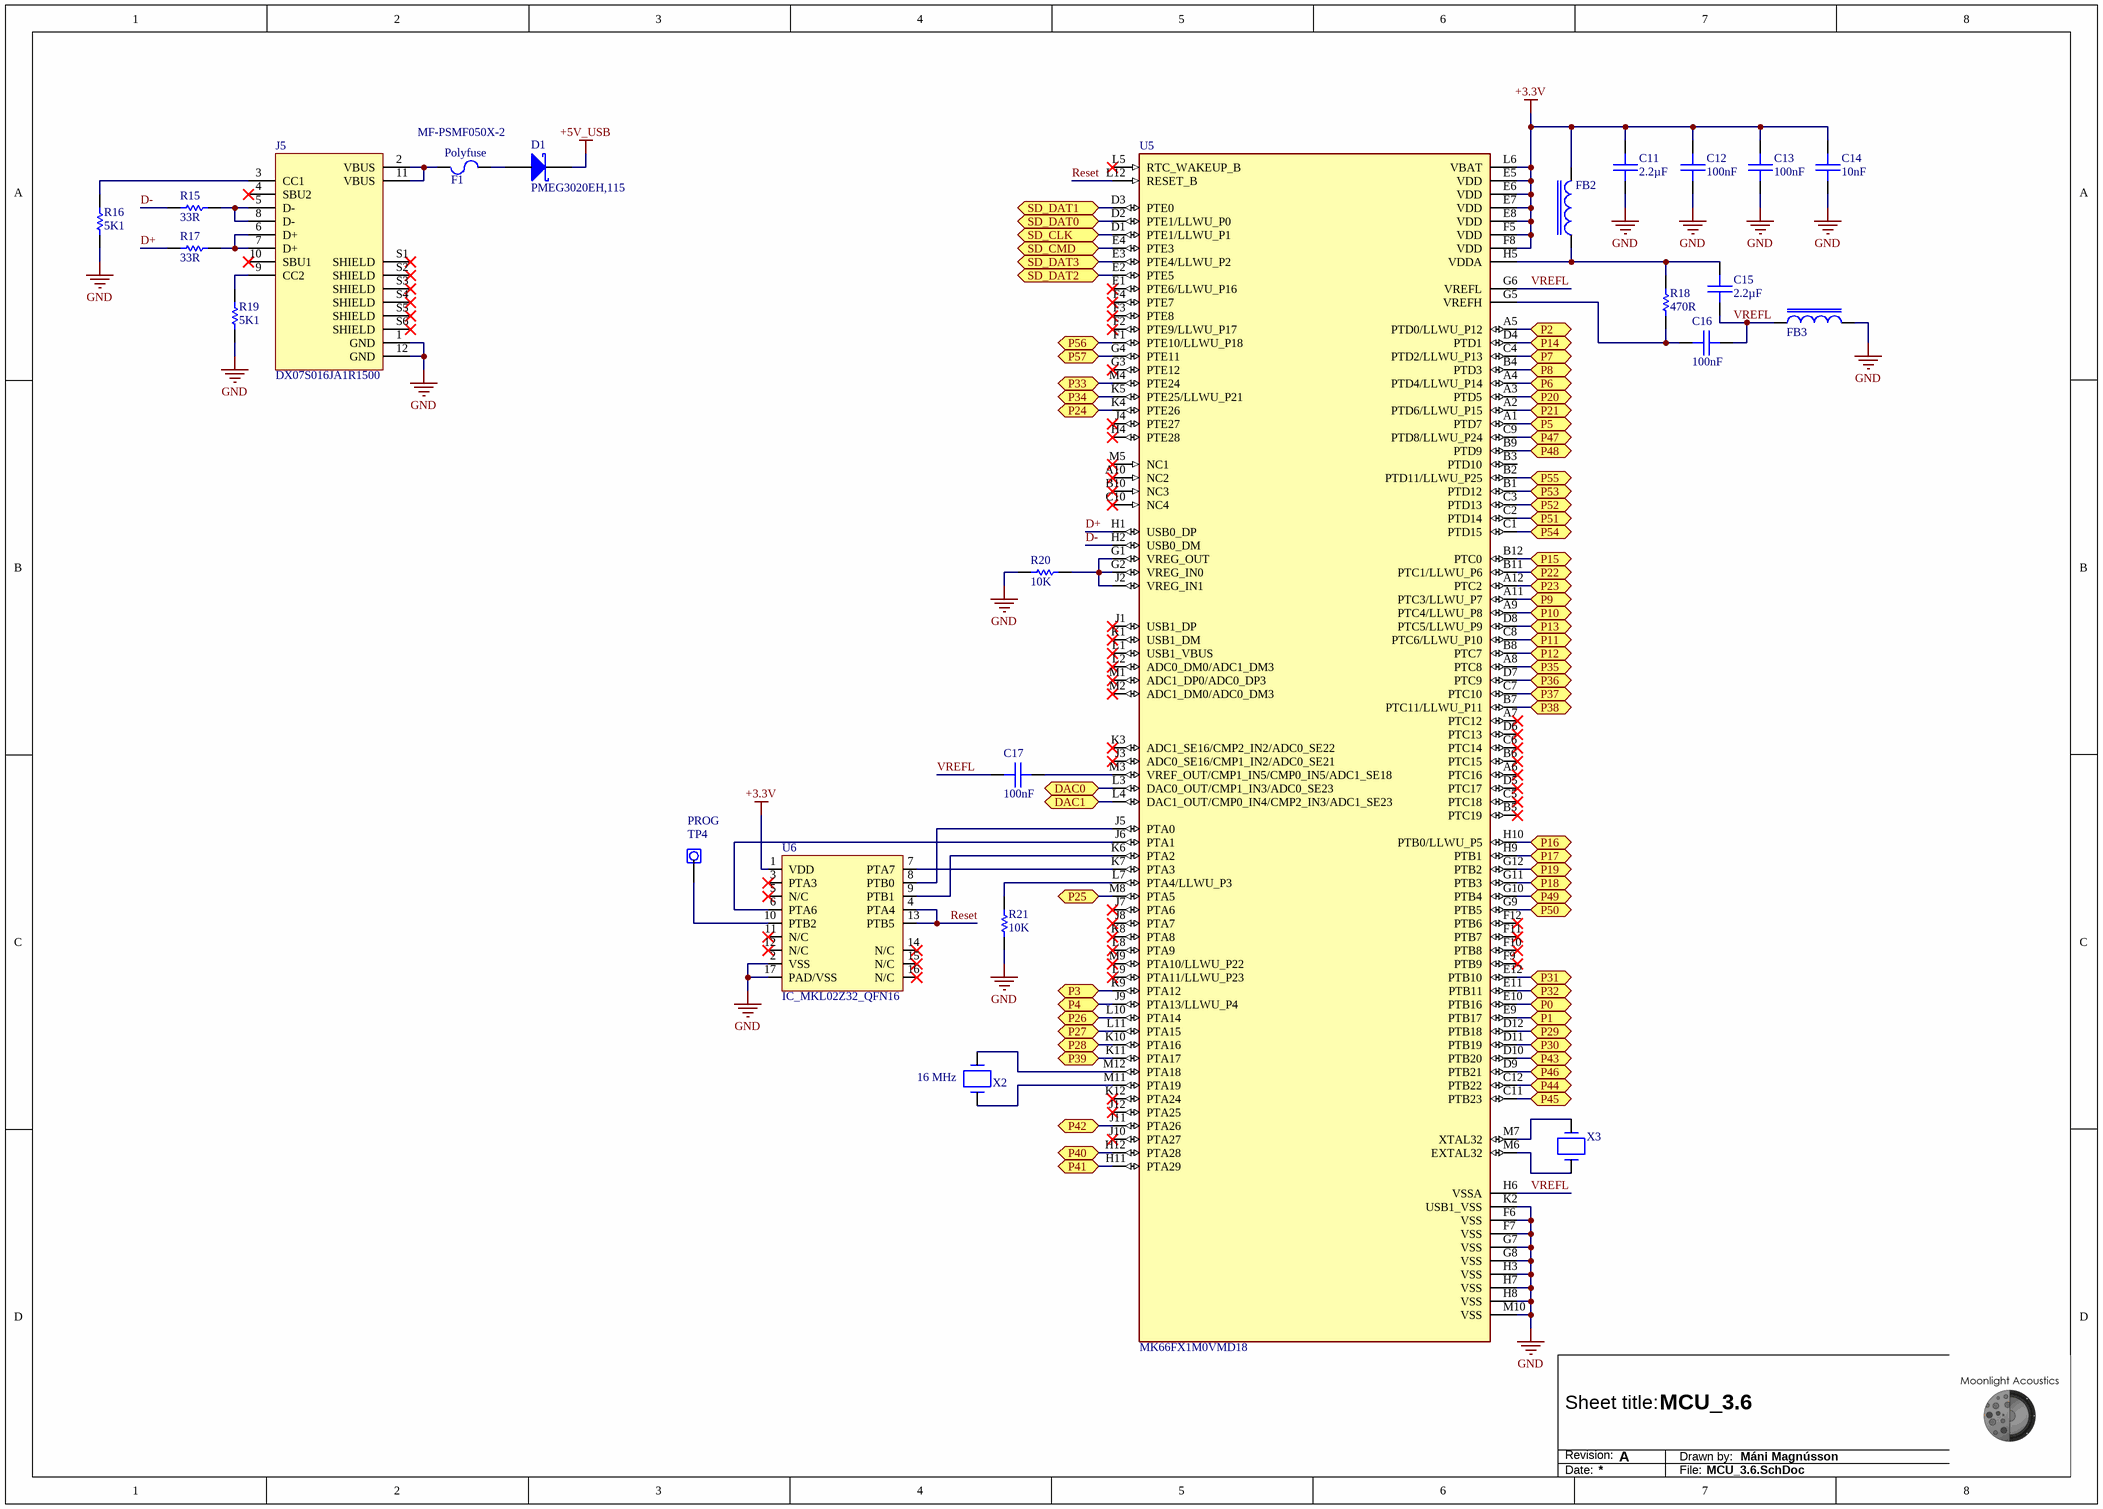
[diagram p9: MCU_3.6.SchDoc]

### Parts
C11  2.2µF  [0603_CAP]
C12  100nF  [0603_CAP]
C13  100nF  [0603_CAP]
C14  10nF  [0603_CAP]
C15  2.2µF  [0603_CAP]
C16  100nF  [0603_CAP]
C17  100nF  [0603_CAP]
D1  PMEG3020EH,115  [SOD-123]
F1  Polyfuse  [0805]
FB2  FBTH1608HL221-T  [0603_FERRITE]  (value not drawn)
FB3  FBTH1608HL221-T  [0603_FERRITE]  (value not drawn)
J5  DX07S016JA1R1500  [JAE_DX07S016JA1R1500]
R15  33R  [0603_RES]
R16  5K1  [0603_RES]
R17  33R  [0603_RES]
R18  470R  [0603_RES]
R19  5K1  [0603_RES]
R20  10K  [0603_RES]
R21  10K  [0603_RES]
TP4  PROG  [Testpoint2]
U5  MK66FX1M0VMD18  [BGA144C100P12X12_1300X1300X170]
U6  IC_MKL02Z32_QFN16  [QFN50P300X300X65-17N]
X2  NX3225SA-16.000000MHZ-B3  [XTAL_NX3225SA]  (value not drawn)
X3  ABS07-166-32.768KHZ-T  [XTAL_ABS07-166]  (value not drawn)

### Ports
DAC0 (bidir), DAC1 (bidir), P0 (bidir), P1 (bidir), P2 (bidir), P3 (bidir), P4 (bidir), P5 (bidir), P6 (bidir), P7 (bidir), P8 (bidir), P9 (bidir), P10 (bidir), P11 (bidir), P12 (bidir), P13 (bidir), P14 (bidir), P15 (bidir), P16 (bidir), P17 (bidir), P18 (bidir), P19 (bidir), P20 (bidir), P21 (bidir), P22 (bidir), P23 (bidir), P24 (bidir), P25 (bidir), P26 (bidir), P27 (bidir), P28 (bidir), P29 (bidir), P30 (bidir), P31 (bidir), P32 (bidir), P33 (bidir), P34 (bidir), P35 (bidir), P36 (bidir), P37 (bidir), P38 (bidir), P39 (bidir), P40 (bidir), P41 (bidir), P42 (bidir), P43 (bidir), P44 (bidir), P45 (bidir), P46 (bidir), P47 (bidir), P48 (bidir), P49 (bidir), P50 (bidir), P51 (bidir), P52 (bidir), P53 (bidir), P54 (bidir), P55 (bidir), P56 (bidir), P57 (bidir), SD_CLK (bidir), SD_CMD (bidir), SD_DAT0 (bidir), SD_DAT1 (bidir), SD_DAT2 (bidir), SD_DAT3 (bidir)

### Nets
+3.3V: C11.1 C12.1 C13.1 C14.1 FB2.2 U5.E5(VDD) U5.E6(VDD) U5.E7(VDD) U5.E8(VDD) U5.F5(VDD) U5.F8(VDD) U5.L6(VBAT) U6.1(VDD)
+5V_USB: D1.2(K)
GND: C11.2 C12.2 C13.2 C14.2 FB3.1 J5.1(GND) J5.12(GND) R16.2 R19.2 R20.1 R21.1 U5.F6(VSS) U5.F7(VSS) U5.G7(VSS) U5.G8(VSS) U5.H3(VSS) U5.H7(VSS) U5.H8(VSS) U5.K2(USB1_VSS) U5.M10(VSS) U6.2(VSS) U6.17(PAD/VSS)
D+: R17.1 U5.H1(USB0_DP)
D-: R15.1 U5.H2(USB0_DM)
Reset: U5.L12(RESET_B) U6.4(PTA4) U6.13(PTB5)
VREFL: C15.2 C16.2 C17.1 FB3.2 U5.G6(VREFL) U5.H6(VSSA)
NetC15_1: C15.1 FB2.1 R18.1 U5.H5(VDDA)
NetC16_1: C16.1 R18.2 U5.G5(VREFH)
NetC17_2: C17.2 U5.M3(VREF_OUT/CMP1_IN5/CMP0_IN5/ADC1_SE18)
NetD1_1: D1.1(A) F1.2
NetF1_1: F1.1 J5.2(VBUS) J5.11(VBUS)
NetJ5_3: J5.3(CC1) R16.1
NetJ5_5: J5.5(D-) J5.8(D-) R15.2
NetJ5_6: J5.6(D+) J5.7(D+) R17.2
NetJ5_9: J5.9(CC2) R19.1
NetR20_2: R20.2 U5.G1(VREG_OUT) U5.G2(VREG_IN0) U5.J2(VREG_IN1)
NetR21_2: R21.2 U5.L7(PTA4/LLWU_P3)
NetTP4_1: TP4.1 U6.10(PTB2)
NetU5_A1: U5.A1(PTD7) ; port P5
NetU5_A2: U5.A2(PTD6/LLWU_P15) ; port P21
NetU5_A3: U5.A3(PTD5) ; port P20
NetU5_A4: U5.A4(PTD4/LLWU_P14) ; port P6
NetU5_A5: U5.A5(PTD0/LLWU_P12) ; port P2
NetU5_A8: U5.A8(PTC8) ; port P35
NetU5_A9: U5.A9(PTC4/LLWU_P8) ; port P10
NetU5_A11: U5.A11(PTC3/LLWU_P7) ; port P9
NetU5_A12: U5.A12(PTC2) ; port P23
NetU5_B1: U5.B1(PTD12) ; port P53
NetU5_B2: U5.B2(PTD11/LLWU_P25) ; port P55
NetU5_B4: U5.B4(PTD3) ; port P8
NetU5_B7: U5.B7(PTC11/LLWU_P11) ; port P38
NetU5_B8: U5.B8(PTC7) ; port P12
NetU5_B9: U5.B9(PTD9) ; port P48
NetU5_B11: U5.B11(PTC1/LLWU_P6) ; port P22
NetU5_B12: U5.B12(PTC0) ; port P15
NetU5_C1: U5.C1(PTD15) ; port P54
NetU5_C2: U5.C2(PTD14) ; port P51
NetU5_C3: U5.C3(PTD13) ; port P52
NetU5_C4: U5.C4(PTD2/LLWU_P13) ; port P7
NetU5_C7: U5.C7(PTC10) ; port P37
NetU5_C8: U5.C8(PTC6/LLWU_P10) ; port P11
NetU5_C9: U5.C9(PTD8/LLWU_P24) ; port P47
NetU5_C11: U5.C11(PTB23) ; port P45
NetU5_C12: U5.C12(PTB22) ; port P44
NetU5_D1: U5.D1(PTE1/LLWU_P1) ; port SD_CLK
NetU5_D2: U5.D2(PTE1/LLWU_P0) ; port SD_DAT0
NetU5_D3: U5.D3(PTE0) ; port SD_DAT1
NetU5_D4: U5.D4(PTD1) ; port P14
NetU5_D7: U5.D7(PTC9) ; port P36
NetU5_D8: U5.D8(PTC5/LLWU_P9) ; port P13
NetU5_D9: U5.D9(PTB21) ; port P46
NetU5_D10: U5.D10(PTB20) ; port P43
NetU5_D11: U5.D11(PTB19) ; port P30
NetU5_D12: U5.D12(PTB18) ; port P29
NetU5_E2: U5.E2(PTE5) ; port SD_DAT2
NetU5_E3: U5.E3(PTE4/LLWU_P2) ; port SD_DAT3
NetU5_E4: U5.E4(PTE3) ; port SD_CMD
NetU5_E9: U5.E9(PTB17) ; port P1
NetU5_E10: U5.E10(PTB16) ; port P0
NetU5_E11: U5.E11(PTB11) ; port P32
NetU5_E12: U5.E12(PTB10) ; port P31
NetU5_F1: U5.F1(PTE10/LLWU_P18) ; port P56
NetU5_G4: U5.G4(PTE11) ; port P57
NetU5_G9: U5.G9(PTB5) ; port P50
NetU5_G10: U5.G10(PTB4) ; port P49
NetU5_G11: U5.G11(PTB3) ; port P18
NetU5_G12: U5.G12(PTB2) ; port P19
NetU5_H9: U5.H9(PTB1) ; port P17
NetU5_H10: U5.H10(PTB0/LLWU_P5) ; port P16
NetU5_H11: U5.H11(PTA29) ; port P41
NetU5_H12: U5.H12(PTA28) ; port P40
NetU5_J5: U5.J5(PTA0) U6.8(PTB0)
NetU5_J6: U5.J6(PTA1) U6.6(PTA6)
NetU5_J9: U5.J9(PTA13/LLWU_P4) ; port P4
NetU5_J11: U5.J11(PTA26) ; port P42
NetU5_K4: U5.K4(PTE26) ; port P24
NetU5_K5: U5.K5(PTE25/LLWU_P21) ; port P34
NetU5_K6: U5.K6(PTA2) U6.9(PTB1)
NetU5_K7: U5.K7(PTA3) U6.7(PTA7)
NetU5_K9: U5.K9(PTA12) ; port P3
NetU5_K10: U5.K10(PTA16) ; port P28
NetU5_K11: U5.K11(PTA17) ; port P39
NetU5_L3: U5.L3(DAC0_OUT/CMP1_IN3/ADC0_SE23) ; port DAC0
NetU5_L4: U5.L4(DAC1_OUT/CMP0_IN4/CMP2_IN3/ADC1_SE23) ; port DAC1
NetU5_L10: U5.L10(PTA14) ; port P26
NetU5_L11: U5.L11(PTA15) ; port P27
NetU5_M4: U5.M4(PTE24) ; port P33
NetU5_M6: U5.M6(EXTAL32) X3.1
NetU5_M7: U5.M7(XTAL32) X3.2
NetU5_M8: U5.M8(PTA5) ; port P25
NetU5_M11: U5.M11(PTA19) X2.1
NetU5_M12: U5.M12(PTA18) X2.3

Not connected (* = marked no-connect by the designer): J5 4(SBU2)* 10(SBU1)* S1(SHIELD)* S2(SHIELD)* S3(SHIELD)* S4(SHIELD)* S5(SHIELD)* S6(SHIELD)*; U5 A6(PTC16)* A7(PTC12)* A10(NC2)* B3(PTD10) B5(PTC19)* B6(PTC15)* B10(NC3)* C5(PTC18)* C6(PTC14)* C10(NC4)* D5(PTC17)* D6(PTC13)* E1(PTE6/LLWU_P16)* F2(PTE9/LLWU_P17)* F3(PTE8)* F4(PTE7)* F9(PTB9)* F10(PTB8)* F11(PTB7)* F12(PTB6)* G3(PTE12)* H4(PTE28)* J1(USB1_DP)* J3(ADC0_SE16/CMP1_IN2/ADC0_SE21)* J4(PTE27)* J7(PTA6)* J8(PTA7)* J10(PTA27)* J12(PTA25)* K1(USB1_DM)* K3(ADC1_SE16/CMP2_IN2/ADC0_SE22)* K8(PTA8)* K12(PTA24)* L1(USB1_VBUS)* L2(ADC0_DM0/ADC1_DM3)* L5(RTC_WAKEUP_B)* L8(PTA9)* L9(PTA11/LLWU_P23)* M1(ADC1_DP0/ADC0_DP3)* M2(ADC1_DM0/ADC0_DM3)* M5(NC1)* M9(PTA10/LLWU_P22)*; U6 3(PTA3)* 5(N/C)* 11(N/C)* 12(N/C)* 14(N/C)* 15(N/C)* 16(N/C)*

### Notes on the sheet
- MF-PSMF050X-2
- (near X2) 16 MHz
- Sheet title:
- Revision:
- Drawn by:
- Date:
- File:

### Library data of the parts
C11-C17 = Capacitor
D1 = Schottky diode
F1 = Fuse
FB2 FB3 = Ferrite Bead: as FB300 on sheet GNSS
J5 = DX07S016JA1R1500: as J200 on sheet RP2040; Value: *; Price: None; Package: None; Availability: Unavailable; MP: DX07S016JA1R1500; DigiKey-Purchase-URL: https://snapeda.com/shop?store=DigiKey&id=4551013; SnapEDA_Link: https://www.snapeda.com/parts/DX07S016JA1R1500/JAE%20Electronics/view-part/4551013/?ref=snap
R15-R21 = Resistor
TP4 = Testpoint
U5 = MK66FX1M0VMD18: 32-bit ARM Cortex-M4F Microcontroller 180 MHz 144-MAPBGA / DigiKey part no. 568-13335-ND; MF: NXP USA; SnapEDA_Link: https://www.snapeda.com/parts/MK66FX1M0VMD18/NXP%20USA%20Inc./view-part/567598/?ref=snap; Availability: Unavailable; MP: MK66FX1M0VMD18; Price: None; Value: *; Package: MAPBGA-144 NXP Semiconductors
U6 = IC_MKL02Z32_QFN16: Teensy bootloader; MP: MKL02Z32VFG4; MF: NXP USA; Availability: Unavailable; Price: None; Value: *; SnapEDA_Link: https://www.snapeda.com/parts/MKL02Z32VFG4/NXP%20USA%20Inc./view-part/492537/?ref=snap; Package: QFN-16 NXP Semiconductors
X2 = XTAL_16 MHz: Digikey part no. 644-1099-1-ND
X3 = XTAL_32.768 kHz: Digikey part no. 535-14514-1-ND / Requires 12pF load capacitors

## Sheet RGB_LED.SchDoc: MoonPilot - RGB LED
size A3; DrawnBy: Máni Magnússon; Revision: A
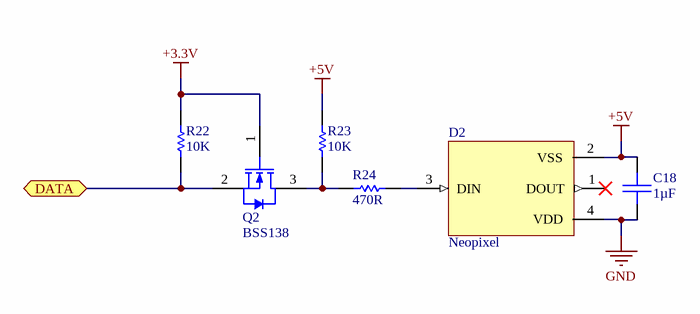
[diagram p10: RGB_LED.SchDoc]

### Parts
C18  1µF  [0603_CAP]
D2  Neopixel  [2659]
Q2  BSS138  [INTR-SOT-23-3_V]
R22  10K  [0603_RES]
R23  10K  [0603_RES]
R24  470R  [0603_RES]

### Ports
DATA (bidir)

### Nets
+3.3V: Q2.1(G) R22.1
+5V: C18.1 D2.2(VSS) R23.1
GND: C18.2 D2.4(VDD)
NetD2_3: D2.3(DIN) R24.2
NetQ2_2: Q2.2(S) R22.2 ; port DATA
NetQ2_3: Q2.3(D) R23.2 R24.1

Not connected (* = marked no-connect by the designer): D2 1(DOUT)*

### Notes on the sheet
- Sheet title:
- Revision:
- Drawn by:
- Date:
- File:

### Library data of the parts
C18 = Capacitor
D2 = Neopixel: Adafruit Neopixel SMD 3535 / Adafruit part no. 2659 / Digikey part no. 1528-1542-ND; MF: Adafruit Industries; MP: 2659; SnapEDA_Link: https://www.snapeda.com/parts/2659/Adafruit%20Industries%20LLC/view-part/548522/?ref=snap; Package: TQFP-32 Adafruit Industries; Digi-Key_Purchase_URL: https://www.digikey.com/product-detail/en/pololu-corporation/2659/2183-2659-ND/10451102?utm_source=snapeda&utm_medium=aggregator&utm_campaign=symbol; Digi-Key_Part_Number: 2183-2659-ND; Value: *
Q2 = IRLML2502TRPBF: as Q3 on sheet Hi_Current; Package Reference: SOT-23-3; Manufacturer URL: http://internationalrectifier.com/; Package Description: 3-Pin Small Outline Transistor, Body 2.92 x 1.3 mm, Pitch 0.95 mm; Datasheet Version: Apr-14; Channel Type: N-Channel; Datasheet URL: https://datasheet.ciiva.com/6383/irlml2502pbf-6383216.pdf
R22-R24 = Resistor

## Nets that join several sheets
+3.3V: Flash (5 pins), MCU_3.6 (13 pins), RGB_LED (Q2.1 R22.1)
+3V3: Main (R100.1 R101.1), RP2040 (20 pins), GNSS (7 pins), IMU_MAG (11 pins), Power (C506.1 TP502.1 U500.5 U502.10), SD_Card (C800.1 J800.P4 R800.1)
+5V: Power (6 pins), Connectors (10 pins), HI_CURR_1 (J6_HI_CURR_1.1), HI_CURR_2 (J6_HI_CURR_2.1), RGB_LED (C18.1 D2.2 R23.1)
+5V_USB: RP2040 (F200.2), Power (D500.1), MCU_3.6 (D1.2)
GND: RP2040 (18 pins), GNSS (21 pins), IMU_MAG (11 pins), Power (29 pins), Connectors (11 pins), HI_CURR_1 (D3_HI_CURR_1.2 Q3_HI_CURR_1.2 R20_HI_CURR_1.2), HI_CURR_2 (D3_HI_CURR_2.2 Q3_HI_CURR_2.2 R20_HI_CURR_2.2), SD_Card (6 pins), Flash (C?.2 U?.4), MCU_3.6 (22 pins), RGB_LED (C18.2 D2.4)
NetJ600_1: RP2040 (U201.2), Connectors (J600.1)
NetJ601_1: RP2040 (U201.3), Connectors (J601.1)
NetJ602_1: RP2040 (U201.4), Connectors (J602.1)
NetJ603_1: RP2040 (U201.5), Connectors (J603.1)
NetJ604_1: RP2040 (U201.6), Connectors (J604.1)
NetJ605_2: RP2040 (U201.31), Connectors (J605.2)
NetJ606_1: RP2040 (U201.7), Connectors (J606.1)
NetJ607_1: RP2040 (U201.8), Connectors (J607.1)
NetJ608_1: RP2040 (U201.9), Connectors (J608.1)
NetJ609_2: RP2040 (U201.16), Connectors (J609.2)
NetJ609_3: RP2040 (U201.15), Connectors (J609.3)
NetJ800_P1: RP2040 (U201.38), SD_Card (J800.P1)
NetJ800_P2: RP2040 (U201.39), SD_Card (J800.P2)
NetJ800_P3: RP2040 (U201.35), SD_Card (J800.P3)
NetJ800_P5: RP2040 (U201.34), SD_Card (J800.P5)
NetJ800_P7: RP2040 (U201.36), SD_Card (J800.P7)
NetJ800_P8: RP2040 (U201.37), SD_Card (J800.P8)
NetR?_1: RP2040 (U201.28), Flash (R?.1 U?.1)
NetU201_11: RP2040 (U201.11), IMU_MAG (U400.16)
NetU201_12: RP2040 (U201.12), IMU_MAG (U400.12)
NetU201_13: RP2040 (U201.13), IMU_MAG (U401.15)
NetU201_27: RP2040 (U201.27), Flash (U?.2)
NetU201_29: RP2040 (U201.29), Flash (U?.6)
NetU201_30: RP2040 (U201.30), Flash (U?.5)
SCL: Main (R100.2), RP2040 (U201.18), GNSS (U300.B1), IMU_MAG (U400.8 U401.1), Power (U502.9), Connectors (J610.2)
SDA: Main (R101.2), RP2040 (U201.17), GNSS (U300.A2), IMU_MAG (U400.9 U401.16), Power (U502.8), Connectors (J610.3)